# EAGLE design Tester_V1 (EAGLE 7.7.0)
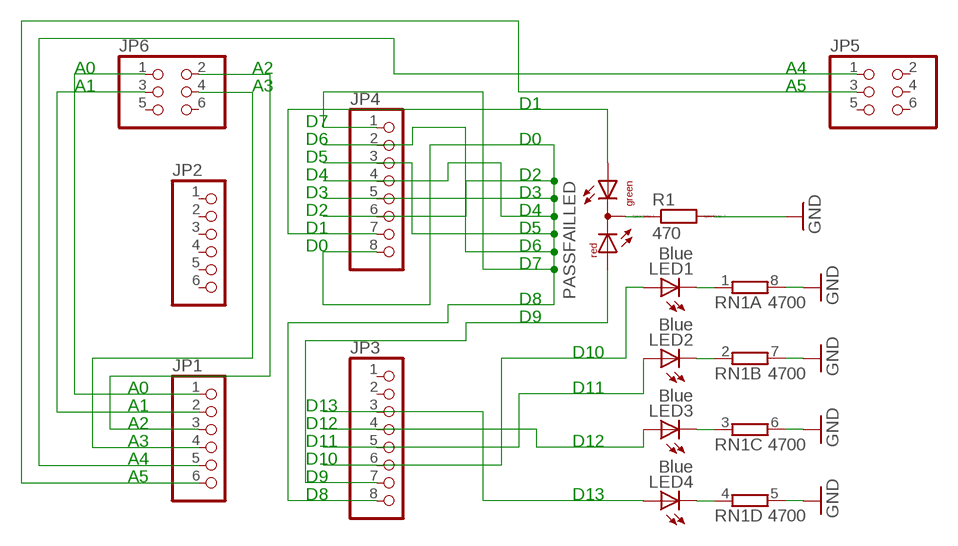
[diagram p0: schematic, sheet 1]

## Parts
JP1  PINHD-1X6  [1X06]
JP2  PINHD-1X6  [1X06]
JP3  PINHD-1X8  [1X08]
JP4  PINHD-1X8  [1X08]
JP5  PINHD-2X3  [2X03]
JP6  PINHD-2X3  [2X03]
LED1  Blue  LED  [SMARTLED-TTW]
LED2  Blue  LED  [SMARTLED-TTW]
LED3  Blue  LED  [SMARTLED-TTW]
LED4  Blue  LED  [SMARTLED-TTW]
PASSFAILLED  DUOLED-RG-C  [DUOLED-C-5MM]
R1  470  R  [R0805]
RN1  4700  4R-N0603-ARV  [0603-ARV]

## Nets
GND: R1.2 RN1.5 RN1.6 RN1.7 RN1.8
N$1: JP3.4 LED3.A@1(A)
N$2: JP3.5 LED2.A@1(A)
N$3: JP3.6 LED1.A@1(A)
N$4: JP4.7 PASSFAILLED.AX(AG)
N$5: JP1.1 JP6.1
N$6: JP1.2 JP6.3
N$7: JP3.8 JP4.1 JP4.2 JP4.3 JP4.4 JP4.5 JP4.6 JP4.8
N$8: JP3.7 PASSFAILLED.AR
N$9: JP1.3 JP6.2
N$10: JP1.4 JP6.4
N$11: LED4.C@1(C) RN1.4
N$12: JP1.5 JP5.1
N$13: JP1.6 JP5.3
N$14: PASSFAILLED.C R1.1
N$15: JP3.3 LED4.A@1(A)
N$16: LED1.C@1(C) RN1.1
N$17: LED3.C@1(C) RN1.3
N$18: LED2.C@1(C) RN1.2
Unconnected: JP2.1 JP2.2 JP2.3 JP2.4 JP2.5 JP2.6 JP3.1 JP3.2 JP5.2 JP5.4 JP5.5 JP5.6 JP6.5 JP6.6

## Notes on the sheet
- A0 | A2 | A4
- A1 | A3 | A5
- D1
- D7
- D6 | D0
- D5
- D4 | D2
- D3 | D3
- D2 | D4
- D1 | D5
- D0 | D6
- D7
- D8
- D9
- D10
- A0 | D11
- A1 | D13
- A2 | D12
- A3 | D11 | D12
- A4 | D10
- A5 | D9
- D8 | D13

## Library data of the parts
JP1 JP2 = pinhead:PINHD-1X6: PIN HEADER
JP3 JP4 = pinhead:PINHD-1X8: PIN HEADER
JP5 JP6 = pinhead:PINHD-2X3: PIN HEADER
LED1-LED4 = led:LED: LED OSRAM: - CHIPLED LG R971, LG N971, LY N971, LG Q971, LY Q971, LO R971, LY R971 LH N974, LH R974 LS Q976, LO Q976, LY Q976 LO Q996 - Hyper CHIPLED LW Q18S LB Q993, LB Q99A, LB R99A - SideLED LS A670, LO A670, LY A670, LG A670, LP A670 LB A673, LV A673, LT A673, LW A673 LH A674 LY A675 LS A676, LA A676, LO A676, LY A676, LW A676 LS A679, LY A679, LG A679 - Hyper Micro SIDELED® LS Y876, LA Y876, LO Y876, LY Y876 LT Y87S - SmartLED LW L88C, LW L88S LB L89C, LB L89S, LG L890 LS L89K, LO L89K, LY L89K LS L896, LA L896, LO L896, LY L896 - TOPLED LS T670, LO T670, LY T670, LG T670, LP T670 LSG T670, LSP T670, LSY T670, LOP T670, LYG T670 LG T671, LOG T671, LSG T671 LB T673, LV T673, LT T673, LW T673 LH T674 LS T676, LA T676, LO T676, LY T676, LB T676, LH T676, LSB T676, LW T676 LB T67C, LV T67C, LT T67C, LS T67K, LO T67K, LY T67K, LW E67C LS E67B, LA E67B, LO E67B, LY E67B, LB E67C, LV E67C, LT E67C LW T67C LS T679, LY T679, LG T679 LS T770, LO T770, LY T770, LG T770, LP T770 LB T773, LV T773, LT T773, LW T773 LH T774 LS E675, LA E675, LY E675, LS T675 LS T776, LA T776, LO T776, LY T776, LB T776 LHGB T686 LT T68C, LB T68C - Hyper Mini TOPLED® LB M676 - Mini TOPLED Santana® LG M470 LS M47K, LO M47K, LY M47K Source: http://www.osram.convergy.de LUXEON: - LUMILED® LXK2-PW12-R00, LXK2-PW12-S00, LXK2-PW14-U00, LXK2-PW14-V00 LXK2-PM12-R00, LXK2-PM12-S00, LXK2-PM14-U00 LXK2-PE12-Q00, LXK2-PE12-R00, LXK2-PE12-S00, LXK2-PE14-T00, LXK2-PE14-U00 LXK2-PB12-K00, LXK2-PB12-L00, LXK2-PB12-M00, LXK2-PB14-N00, LXK2-PB14-P00, LXK2-PB14-Q00 LXK2-PR12-L00, LXK2-PR12-M00, LXK2-PR14-Q00, LXK2-PR14-R00 LXK2-PD12-Q00, LXK2-PD12-R00, LXK2-PD12-S00 LXK2-PH12-R00, LXK2-PH12-S00 LXK2-PL12-P00, LXK2-PL12-Q00, LXK2-PL12-R00 Source: www.luxeon.com KINGBRIGHT: KA-3528ASYC Source: www.kingbright.com
PASSFAILLED = led:DUOLED-RG-C: DUO LED 2 colors (red/green), 5 mm, round, common Cathode www.ligitek.com or other producers.
R1 = eagle-ltspice:R: RESISTOR, European symbol; SPICEMODEL: NONE; SPICEPREFIX: R
RN1 = resistor-dil:4R-N: Array Chip Resistor Source: RS Component / Phycomp; OC_FARNELL: unknown; OC_NEWARK: unknown

## Board
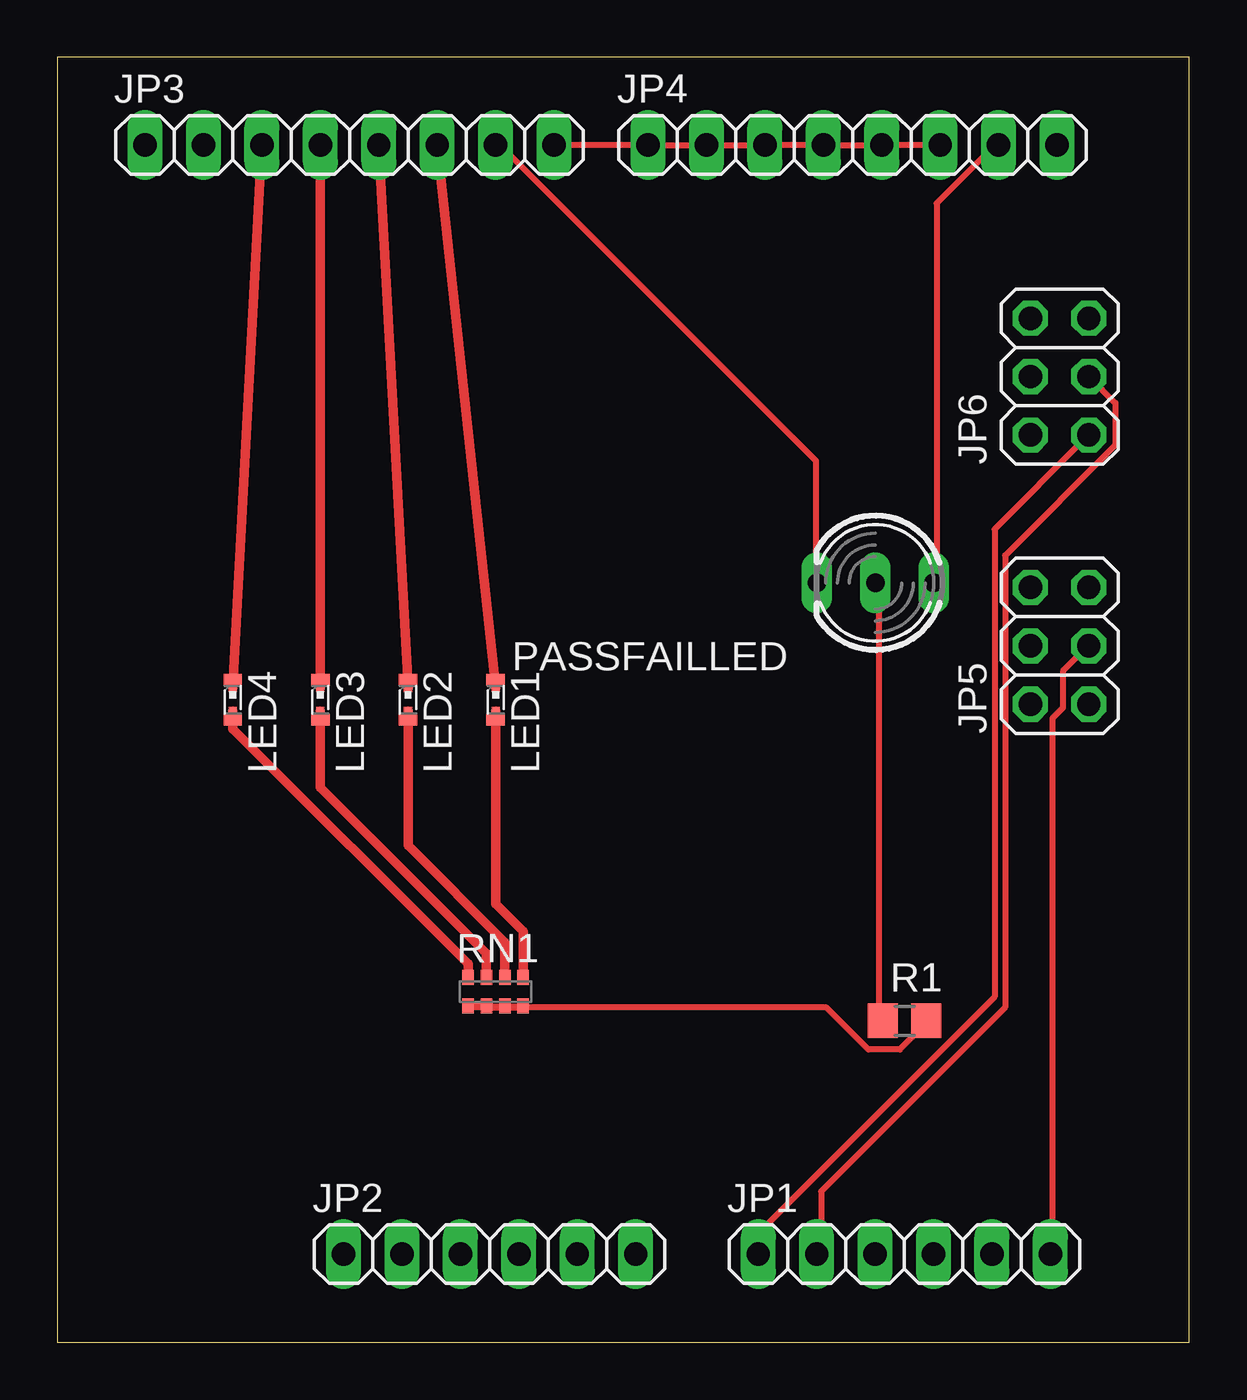
[diagram p1: board, top side]
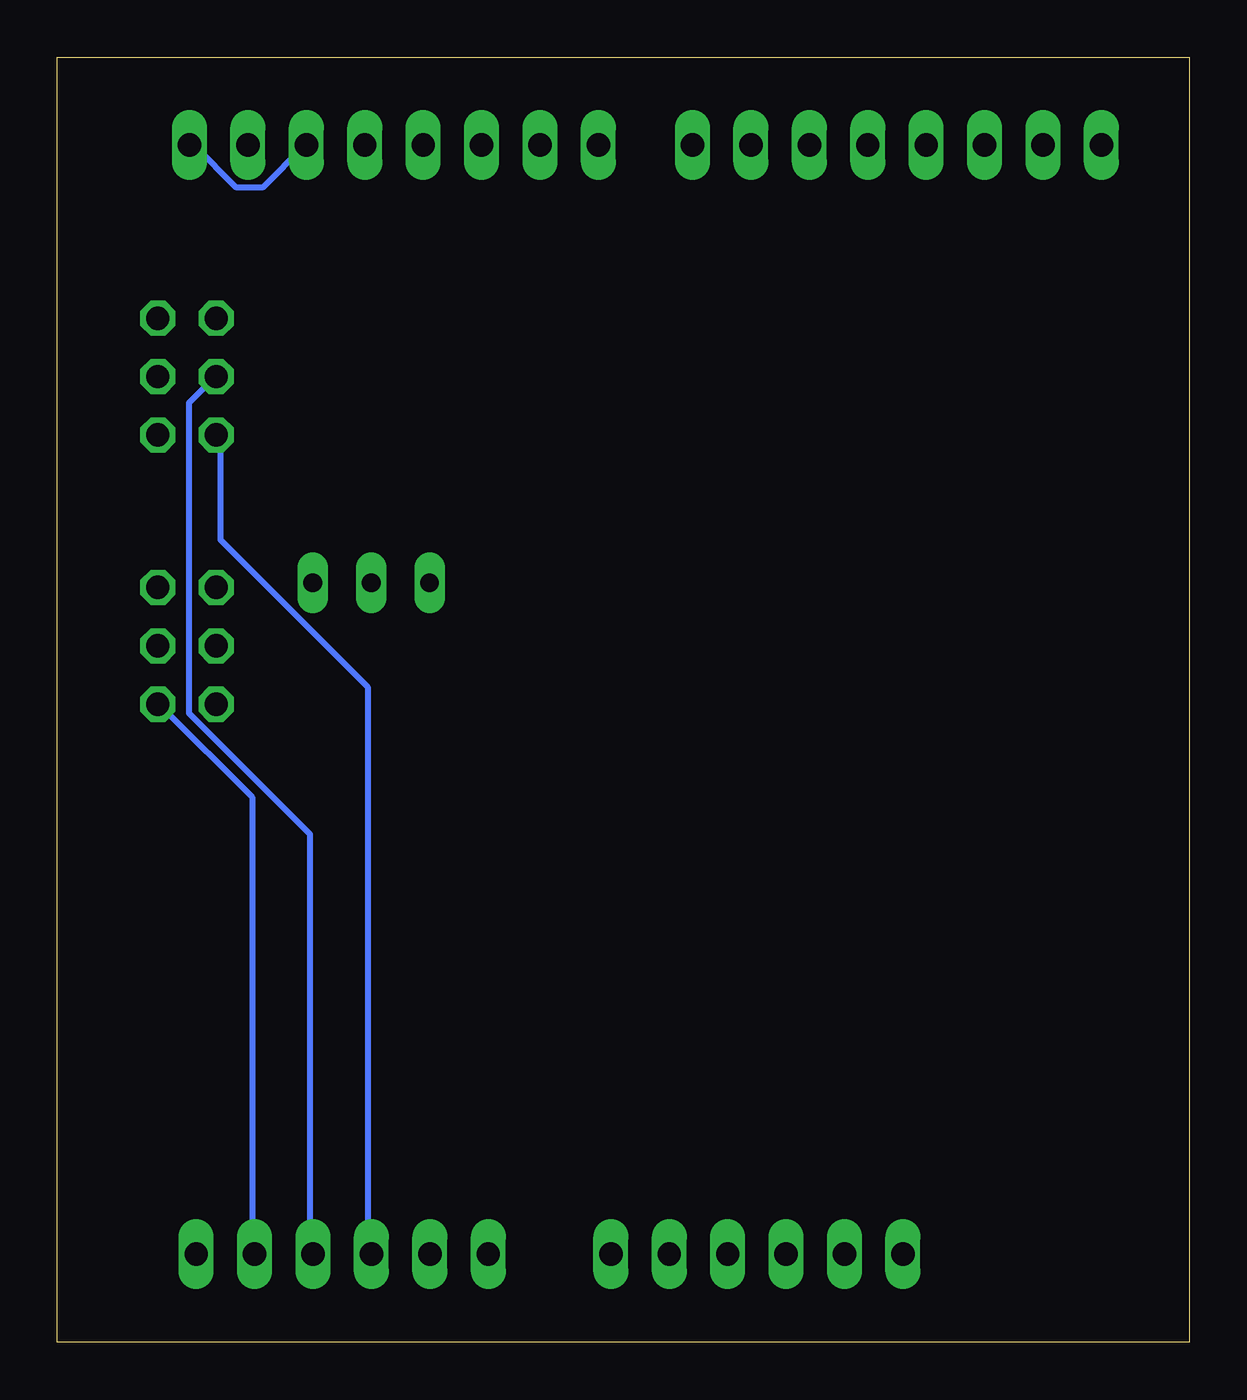
[diagram p2: board, bottom side, seen from below]

Size 49.2 x 55.87 mm. Coordinates in mm from the lower left corner, seen from the top.
Outline: 0,0 49.2,0 49.2,55.87 0,55.87 0,0
Copper layers (1*16): Top 0.035mm / dielectric 1.5mm / Bottom 0.035mm
Design rules "default": minimum track width 10mil, minimum drill 24mil, track to track 8mil, track to pad 8mil, pad to pad 8mil, via to via 8mil, smd to smd 8mil, copper to edge 40mil, drill to drill 8mil, minimum pad ring 10mil, minimum via ring 8mil, stop-mask expansion 4mil, vias tented up to drill 0mil, thermal gap 10mil

### Footprints (pad centres in the part's own frame; a part is rotated, then mirrored left to right if it is on the bottom)
1X06 = drill 1.016 long: 1 -6.35,0; 2 -3.81,0; 3 -1.27,0; 4 1.27,0; 5 3.81,0; 6 6.35,0
1X08 = drill 1.016 long: 1 -8.89,0; 2 -6.35,0; 3 -3.81,0; 4 -1.27,0; 5 1.27,0; 6 3.81,0; 7 6.35,0; 8 8.89,0
2X03 = drill 1.016 octagon: 1 -2.54,-1.27; 2 -2.54,1.27; 3 0,-1.27; 4 0,1.27; 5 2.54,-1.27; 6 2.54,1.27
SMARTLED-TTW = smd 0.8 x 0.5: A 0,-0.875; C 0,0.875 | smd 0.35 x 0.35: A@1 0,-0.5; C@1 0,0.5
DUOLED-C-5MM = drill 0.813 long: AR 2.54,0; AX -2.54,0; C 0,0
R0805 = smd 1.3 x 1.5: 1 -0.95,0; 2 0.95,0
0603-ARV = smd 0.5 x 0.65: 1 -1.2,-0.625; 2 -0.4,-0.625; 3 0.4,-0.625; 4 1.2,-0.625; 5 1.2,0.625; 6 0.4,0.625; 7 -0.4,0.625; 8 -1.2,0.625

### Placement (x,y rotation side)
JP1  36.82,3.82 0 top
JP2  18.79,3.82 0 top
JP3  12.7,52.07 0 top
JP4  34.57,52.07 0 top
JP5  43.57,30.28 90 top
JP6  43.57,41.99 90 top
LED1  19.05,27.94 180 top
LED2  15.24,27.94 180 top
LED3  11.43,27.94 180 top
LED4  7.62,27.94 180 top
PASSFAILLED  35.56,33.02 180 top
R1  36.83,13.97 0 top
RN1  19.05,15.24 180 top

### Tracks (layer width: path | path; a pad name or v marks a point on that pad's centre or on a via)
GND
  Top 0.254: RN1.8 17.88,14.55 18.57,14.55 RN1.7 18.8,14.55 19.25,14.55 RN1.6 19.48,14.55 20.17,14.55 RN1.5 20.4,14.55 33.43,14.55 35.26,12.72 36.63,12.72 37.77,13.87 R1.2
N$1
  Top 0.406: JP3.4 LED3.A@1
N$2
  Top 0.406: JP3.5 LED2.A@1
N$3
  Top 0.406: JP3.6 LED1.A@1
N$4
  Top 0.254: PASSFAILLED.AX 38.23,33.07 38.23,49.53 40.74,52.05 JP4.7
N$5
  Top 0.254: JP1.1 30.68,4.04 30.68,4.95 40.74,15.01 40.74,35.36 44.63,39.24 JP6.1
N$6
  Top 0.254: JP1.2 33.2,4.04 33.2,6.55 41.2,14.55 41.2,34.21 46,39.01 46,40.84 44.86,41.99 JP6.3
N$7
  Top 0.254: JP4.6 38.23,52.05 35.94,52.05 JP4.5 35.71,52.05 33.43,52.05 JP4.4 33.2,52.05 30.91,52.05 JP4.3 30.68,52.05 28.4,52.05 JP4.2 28.17,52.05 25.88,52.05 JP4.1 25.65,52.05 21.77,52.05 JP3.8
  Bottom 0.254: JP4.8 43.26,52.05 41.43,50.22 40.28,50.22 38.46,52.05 JP4.6
N$8
  Top 0.254: PASSFAILLED.AR 32.97,33.07 32.97,38.33 19.25,52.05 JP3.7
N$9
  Bottom 0.254: JP1.3 35.71,4.04 35.71,28.5 42.11,34.9 42.11,39.24 JP6.2
N$10
  Bottom 0.254: JP1.4 38.23,4.04 38.23,22.1 43.48,27.36 43.48,40.84 42.34,41.99 JP6.4
N$11
  Top 0.406: RN1.4 17.85,16.44 7.62,26.67 LED4.C@1
N$12
  Bottom 0.254: JP1.5 40.74,4.04 40.74,23.7 44.63,27.58 JP5.1
N$13
  Top 0.254: JP1.6 43.26,4.04 43.26,27.13 43.71,27.58 43.71,29.18 44.63,30.1 JP5.3
N$14
  Top 0.254: R1.1 35.71,14.1 35.71,32.84 PASSFAILLED.C
N$15
  Top 0.406: JP3.3 LED4.A@1
N$16
  Top 0.406: RN1.1 20.25,17.85 19.05,19.05 LED1.C@1
N$17
  Top 0.406: RN1.3 18.65,16.91 11.43,24.13 LED3.C@1
N$18
  Top 0.406: RN1.2 19.45,17.38 15.24,21.59 LED2.C@1